# EAGLE design BRD1001-001-320 - Counting Registers (EAGLE 9.4.2)
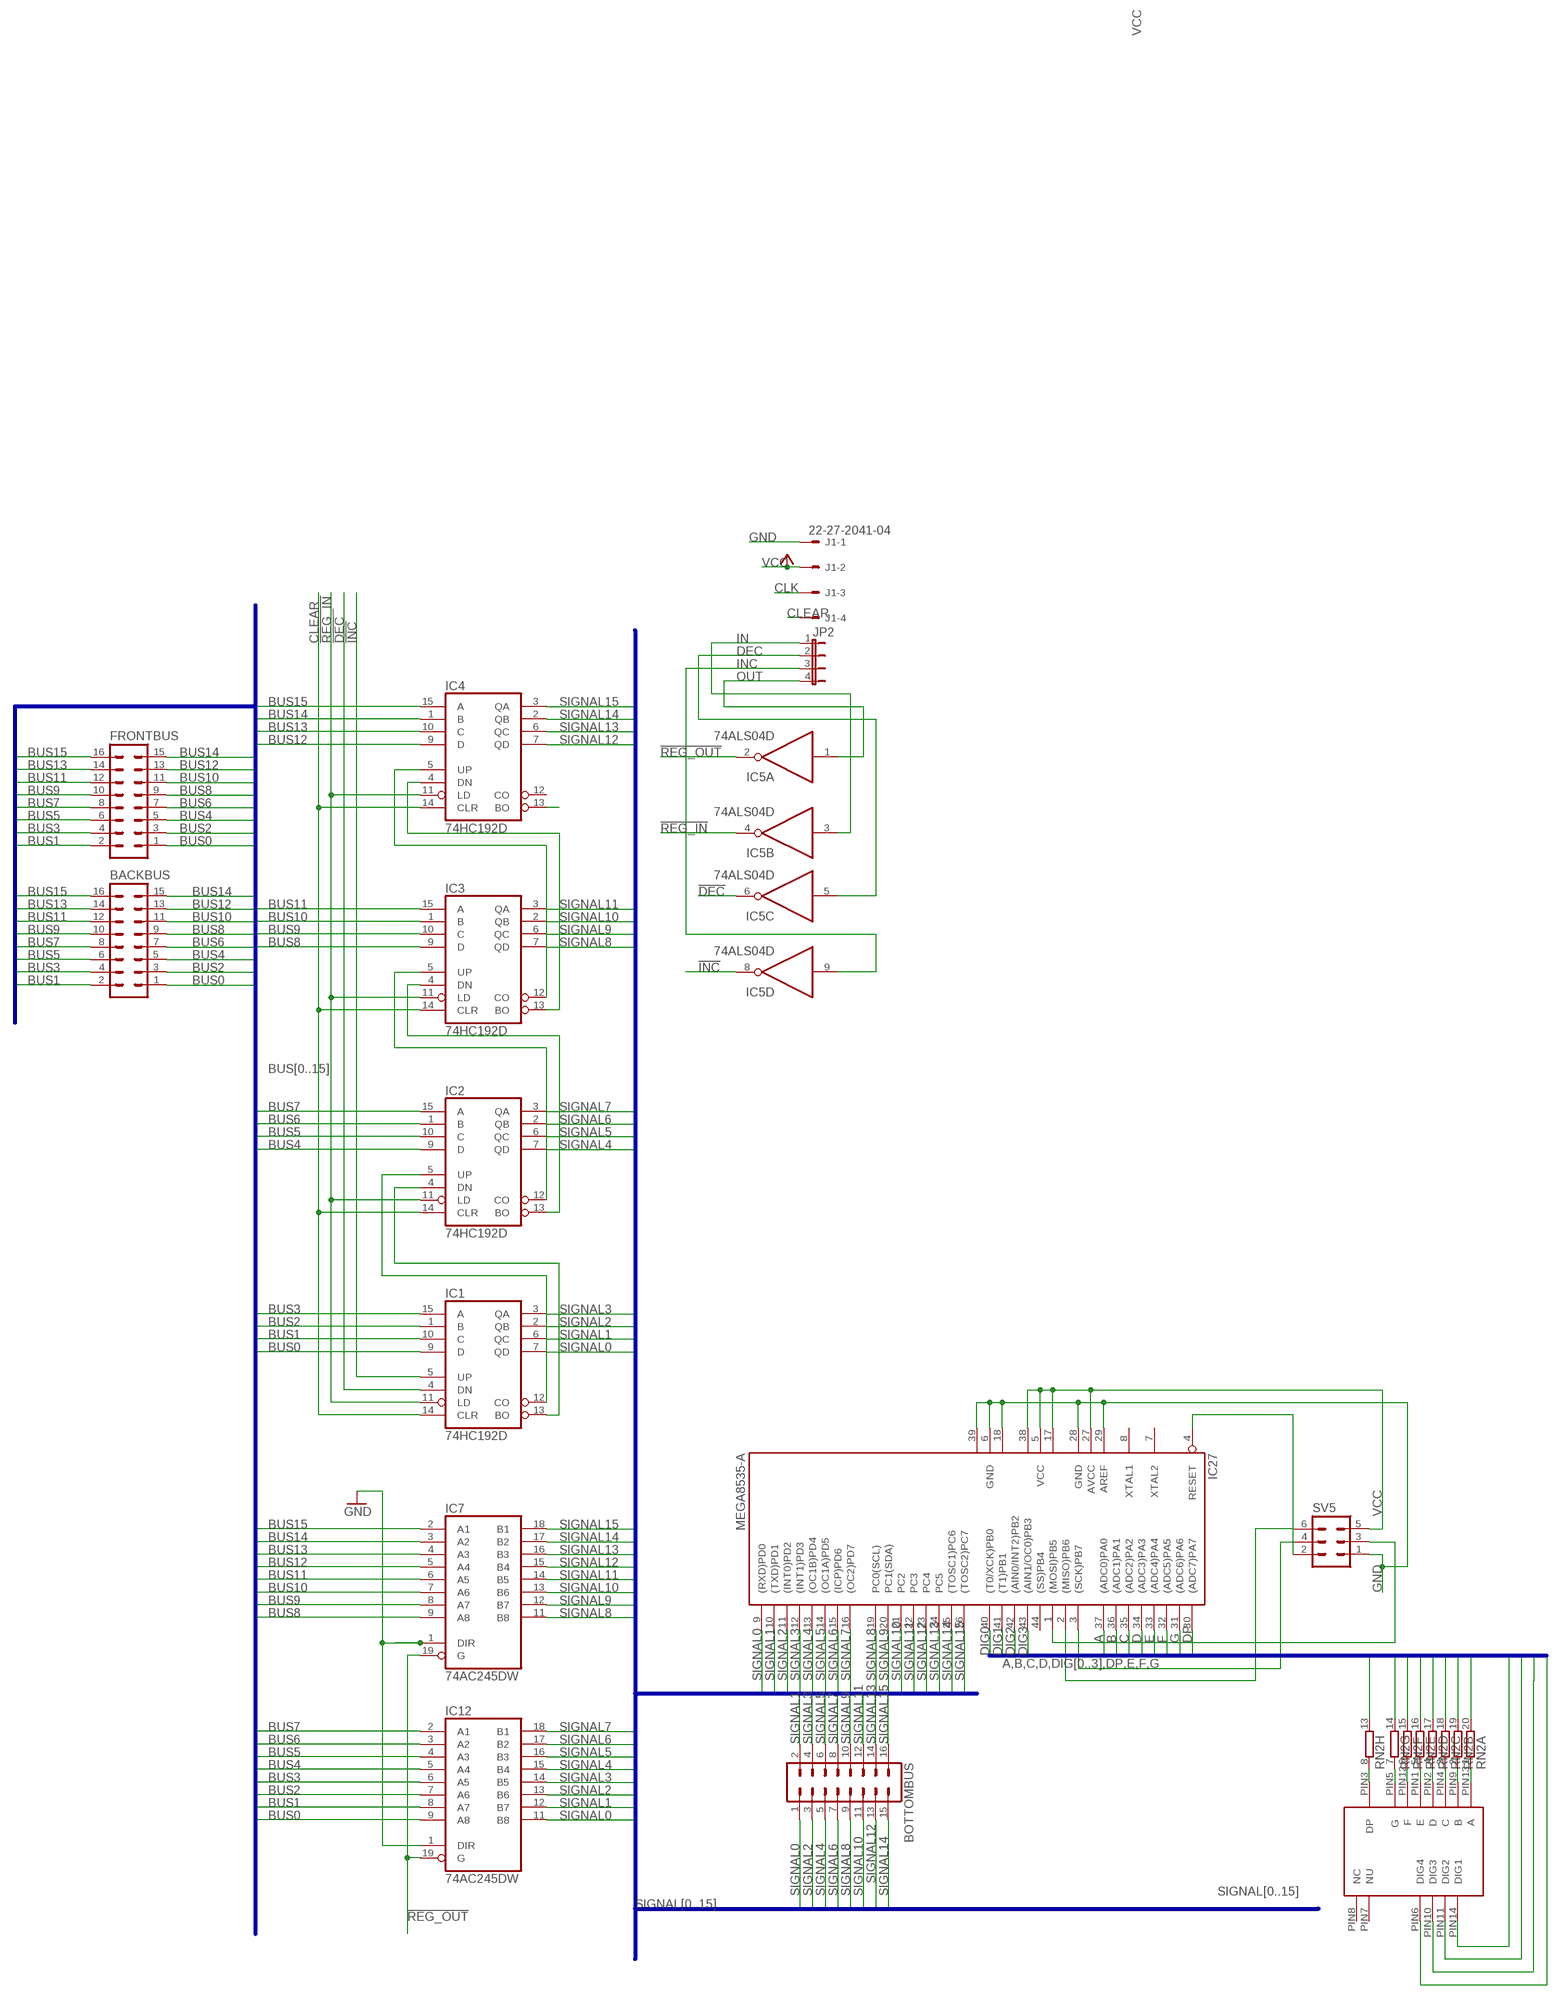
[diagram p0: schematic, sheet 1]

## Parts
BACKBUS  ML16  [ML16]
BOTTOMBUS  ML16  [ML16]
FRONTBUS  ML16  [ML16]
IC1  74HC192D  [SO16]
IC2  74HC192D  [SO16]
IC3  74HC192D  [SO16]
IC4  74HC192D  [SO16]
IC5  74ALS04D  [SO14]
IC7  74AC245DW  [SO20W]
IC12  74AC245DW  [SO20W]
IC27  MEGA8535-A  [TQFP44]
J1  22-27-2041-04  [6410-04]
JP2  JP4E  [JP4]
RN2  10R-NSOMC  [SOMC20]
SV5  ML6  [ML6]
U$1  4-DIGIT-7-SEGMENT  [4-DIGIT-7-SEGMENT]

## Nets
!DEC: IC1.4(DN) IC5.6(C:O)
!INC: IC1.5(UP) IC5.8(D:O)
!REG_IN: IC1.11(LD) IC2.11(LD) IC3.11(LD) IC4.11(LD) IC5.4(B:O)
!REG_OUT: IC5.2(A:O) IC7.19(G) IC12.19(G)
A: IC27.37((ADC0)PA0) RN2.20
B: IC27.36((ADC1)PA1) RN2.19
BUS0: BACKBUS.1 FRONTBUS.1 IC1.9(D) IC12.9(A8)
BUS1: BACKBUS.2 FRONTBUS.2 IC1.10(C) IC12.8(A7)
BUS2: BACKBUS.3 FRONTBUS.3 IC1.1(B) IC12.7(A6)
BUS3: BACKBUS.4 FRONTBUS.4 IC1.15(A) IC12.6(A5)
BUS4: BACKBUS.5 FRONTBUS.5 IC2.9(D) IC12.5(A4)
BUS5: BACKBUS.6 FRONTBUS.6 IC2.10(C) IC12.4(A3)
BUS6: BACKBUS.7 FRONTBUS.7 IC2.1(B) IC12.3(A2)
BUS7: BACKBUS.8 FRONTBUS.8 IC2.15(A) IC12.2(A1)
BUS8: BACKBUS.9 FRONTBUS.9 IC3.9(D) IC7.9(A8)
BUS9: BACKBUS.10 FRONTBUS.10 IC3.10(C) IC7.8(A7)
BUS10: BACKBUS.11 FRONTBUS.11 IC3.1(B) IC7.7(A6)
BUS11: BACKBUS.12 FRONTBUS.12 IC3.15(A) IC7.6(A5)
BUS12: BACKBUS.13 FRONTBUS.13 IC4.9(D) IC7.5(A4)
BUS13: BACKBUS.14 FRONTBUS.14 IC4.10(C) IC7.4(A3)
BUS14: BACKBUS.15 FRONTBUS.15 IC4.1(B) IC7.3(A2)
BUS15: BACKBUS.16 FRONTBUS.16 IC4.15(A) IC7.2(A1)
C: IC27.35((ADC2)PA2) RN2.18
CLEAR: IC1.14(CLR) IC2.14(CLR) IC3.14(CLR) IC4.14(CLR) J1.4
CLK: J1.3
D: IC27.34((ADC3)PA3) RN2.17
DEC: IC5.5(C:I) JP2.2
DIG0: IC27.40((T0/XCK)PB0) U$1.PIN14(DIG1)
DIG1: IC27.41((T1)PB1) U$1.PIN11(DIG2)
DIG2: IC27.42((AIN0/INT2)PB2) U$1.PIN10(DIG3)
DIG3: IC27.43((AIN1/OC0)PB3) U$1.PIN6(DIG4)
DP: IC27.30((ADC7)PA7) RN2.13
E: IC27.33((ADC4)PA4) RN2.16
F: IC27.32((ADC5)PA5) RN2.15
G: IC27.31((ADC6)PA6) RN2.14
GND: IC7.1(DIR) IC12.1(DIR) IC27.6(GND) IC27.18(GND1) IC27.28(GND) IC27.29(AREF) IC27.39(GND2) J1.1 SV5.1
IN: IC5.3(B:I) JP2.1
INC: IC5.9(D:I) JP2.3
N$1: IC4.13(BO)
N$2: IC1.12(CO) IC2.5(UP)
N$3: IC1.13(BO) IC2.4(DN)
N$4: IC2.12(CO) IC3.5(UP)
N$5: IC2.13(BO) IC3.4(DN)
N$6: IC3.12(CO) IC4.5(UP)
N$7: IC3.13(BO) IC4.4(DN)
N$18: IC27.1((MOSI)PB5) SV5.3
N$19: IC27.3((SCK)PB7) SV5.4
N$20: IC27.2((MISO)PB6) SV5.6
N$21: IC27.4(RESET) SV5.2
N$24: RN2.1 U$1.PIN13(A)
N$25: RN2.2 U$1.PIN9(B)
N$26: RN2.3 U$1.PIN4(C)
N$27: RN2.4 U$1.PIN2(D)
N$28: RN2.5 U$1.PIN1(E)
N$29: RN2.6 U$1.PIN12(F)
N$30: RN2.7 U$1.PIN5(G)
N$31: RN2.8 U$1.PIN3(DP)
OUT: IC5.1(A:I) JP2.4
SIGNAL0: BOTTOMBUS.1 IC1.7(QD) IC12.11(B8) IC27.9((RXD)PD0)
SIGNAL1: BOTTOMBUS.2 IC1.6(QC) IC12.12(B7) IC27.10((TXD)PD1)
SIGNAL2: BOTTOMBUS.3 IC1.2(QB) IC12.13(B6) IC27.11((INT0)PD2)
SIGNAL3: BOTTOMBUS.4 IC1.3(QA) IC12.14(B5) IC27.12((INT1)PD3)
SIGNAL4: BOTTOMBUS.5 IC2.7(QD) IC12.15(B4) IC27.13((OC1B)PD4)
SIGNAL5: BOTTOMBUS.6 IC2.6(QC) IC12.16(B3) IC27.14((OC1A)PD5)
SIGNAL6: BOTTOMBUS.7 IC2.2(QB) IC12.17(B2) IC27.15((ICP)PD6)
SIGNAL7: BOTTOMBUS.8 IC2.3(QA) IC12.18(B1) IC27.16((OC2)PD7)
SIGNAL8: BOTTOMBUS.9 IC3.7(QD) IC7.11(B8) IC27.19(PC0(SCL))
SIGNAL9: BOTTOMBUS.10 IC3.6(QC) IC7.12(B7) IC27.20(PC1(SDA))
SIGNAL10: BOTTOMBUS.11 IC3.2(QB) IC7.13(B6) IC27.21(PC2)
SIGNAL11: BOTTOMBUS.12 IC3.3(QA) IC7.14(B5) IC27.22(PC3)
SIGNAL12: BOTTOMBUS.13 IC4.7(QD) IC7.15(B4) IC27.23(PC4)
SIGNAL13: BOTTOMBUS.14 IC4.6(QC) IC7.16(B3) IC27.24(PC5)
SIGNAL14: BOTTOMBUS.15 IC4.2(QB) IC7.17(B2) IC27.25((TOSC1)PC6)
SIGNAL15: BOTTOMBUS.16 IC4.3(QA) IC7.18(B1) IC27.26((TOSC2)PC7)
VCC: IC27.5(VCC) IC27.17(VCC1) IC27.27(AVCC) IC27.38(VCC2) J1.2 SV5.5
Unconnected: IC4.12(CO) IC5.10(E:O) IC5.11(E:I) IC5.12(F:O) IC5.13(F:I) IC27.7(XTAL2) IC27.8(XTAL1) IC27.44((SS)PB4) RN2.9 RN2.10 RN2.11 RN2.12 U$1.PIN7(NU) U$1.PIN8(NC)

## Buses
BUS[0..15]
SIGNAL[0..15]
A,B,C,D,DIG[0..3],DP,E,F,G

## Power pins joined to a net without a drawn wire
GND: IC1.8(GND) IC2.8(GND) IC3.8(GND) IC4.8(GND) IC5.7(P:GND) IC7.10(GND) IC12.10(GND)
VCC: IC1.16(VCC) IC2.16(VCC) IC3.16(VCC) IC4.16(VCC) IC5.14(P:VCC) IC7.20(VCC) IC12.20(VCC)

## Library data of the parts
BACKBUS BOTTOMBUS FRONTBUS = con-harting-ml:ML16: HARTING; OC_FARNELL: unknown; OC_NEWARK: unknown
IC1-IC4 = 74xx-eu:74*192: Synchronous 4-bit UP/DOWN COUNTER
IC5 = 74xx-us:74*04: Hex INVERTER
IC7 IC12 = 74xx-eu:74*245: Octal BUS TRANSCEIVER, 3-state
IC27 = atmel:MEGA8535: MICROCONTROLLER 8 Kbytes FLASH 512 bytes SRAM 512 bytes EEPROM USART 8-channel 10 bit ADC Source: avr.lbr; MPN: ATMEGA8535-16AU; OC_FARNELL: 1528437; OC_NEWARK: 01M6908
J1 = con-molex:22-?-04: CONNECTOR wire to board 2.54 mm (.1 inch) pitch header; MF: MOLEX; OC_FARNELL: unknown; OC_NEWARK: unknown
JP2 = jumper:JP4E: JUMPER
RN2 = resistor-dil:10R-N: DIL RESISTOR; OC_FARNELL: unknown; OC_NEWARK: unknown
SV5 = con-harting-ml:ML6: HARTING; OC_FARNELL: unknown; OC_NEWARK: unknown
U$1 = ADAFRUIT:4-DIGIT-7-SEGMENT

## Board
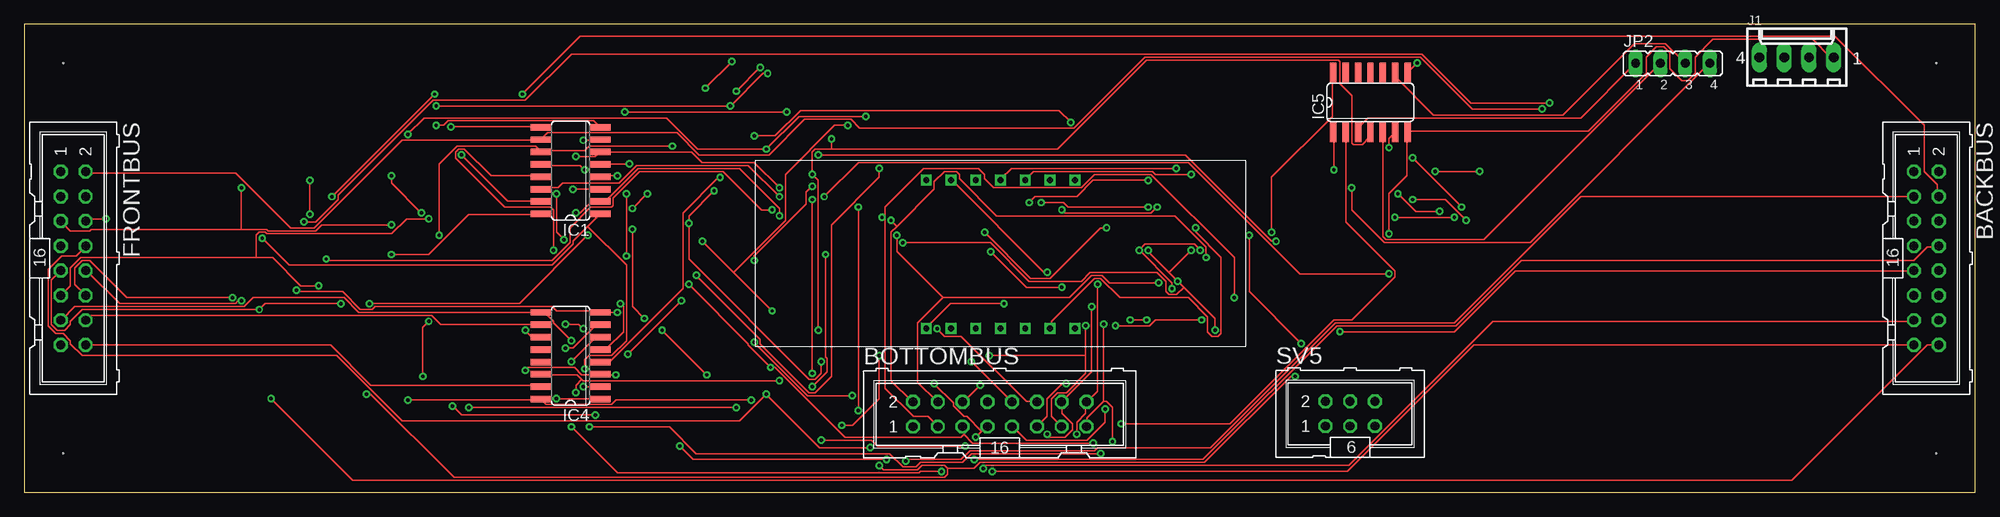
[diagram p1: board, top side]
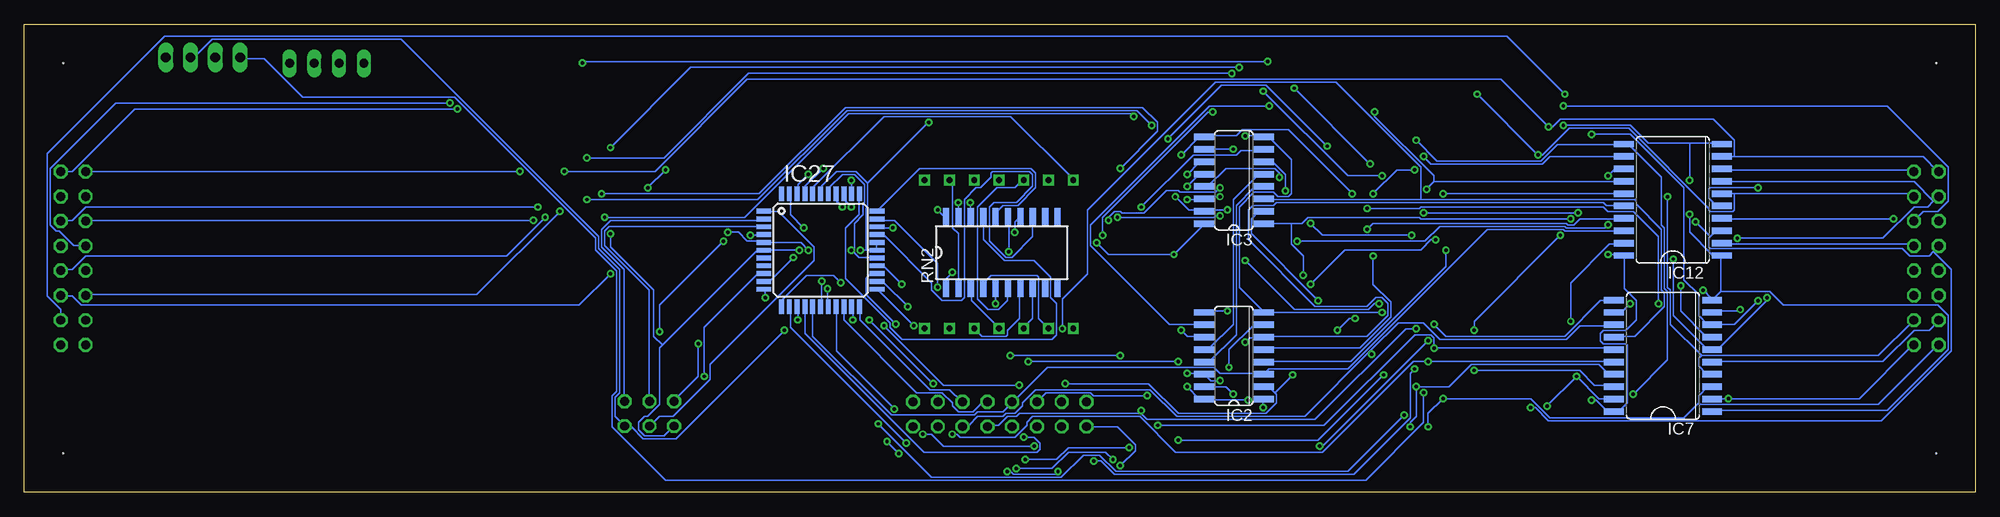
[diagram p2: board, bottom side, seen from below]

Size 200 x 48 mm. Coordinates in mm from the lower left corner, seen from the top.
Outline: 0,0 200,0 200,48 0,48 0,0
Copper layers (1*16): Top 0.035mm / dielectric 1.5mm / Bottom 0.035mm
Design rules "default": minimum track width 6mil, minimum drill 0.35mm, track to track 6mil, track to pad 6mil, pad to pad 6mil, via to via 6mil, smd to smd 6mil, copper to edge 40mil, drill to drill 6mil, minimum pad ring 10mil, minimum via ring 8mil, stop-mask expansion 4mil, vias tented up to drill 0mil, thermal gap 10mil
Holes 0.12 mm at 4,4 196,44 4,44 196,4

### Footprints (pad centres in the part's own frame; a part is rotated, then mirrored left to right if it is on the bottom)
ML16 = drill 0.914 octagon: 1 -8.89,-1.27; 2 -8.89,1.27; 3 -6.35,-1.27; 4 -6.35,1.27; 5 -3.81,-1.27; 6 -3.81,1.27; 7 -1.27,-1.27; 8 -1.27,1.27; 9 1.27,-1.27; 10 1.27,1.27; 11 3.81,-1.27; 12 3.81,1.27; 13 6.35,-1.27; 14 6.35,1.27; 15 8.89,-1.27; 16 8.89,1.27
SO16 = smd 0.66 x 2.032: 1 -4.445,-3.073; 2 -3.175,-3.073; 3 -1.905,-3.073; 4 -0.635,-3.073; 5 0.635,-3.073; 6 1.905,-3.073; 7 3.175,-3.073; 8 4.445,-3.073; 9 4.445,3.073; 10 3.175,3.073; 11 1.905,3.073; 12 0.635,3.073; 13 -0.635,3.073; 14 -1.905,3.073; 15 -3.175,3.073; 16 -4.445,3.073
SO14 = smd 0.66 x 2.032: 1 -3.81,-3.073; 2 -2.54,-3.073; 3 -1.27,-3.073; 4 0,-3.073; 5 1.27,-3.073; 6 2.54,-3.073; 7 3.81,-3.073; 8 3.81,3.073; 9 2.54,3.073; 10 1.27,3.073; 11 0,3.073; 12 -1.27,3.073; 13 -2.54,3.073; 14 -3.81,3.073
SO20W = smd 0.66 x 2.032: 1 -5.715,-5.029; 2 -4.445,-5.029; 3 -3.175,-5.029; 4 -1.905,-5.029; 5 -0.635,-5.029; 6 0.635,-5.029; 7 1.905,-5.029; 8 3.175,-5.029; 9 4.445,-5.029; 10 5.715,-5.029; 11 5.715,5.029; 12 4.445,5.029; 13 3.175,5.029; 14 1.905,5.029; 15 0.635,5.029; 16 -0.635,5.029; 17 -1.905,5.029; 18 -3.175,5.029; 19 -4.445,5.029; 20 -5.715,5.029
TQFP44 = smd 1.5 x 0.5: 1 -5.8,4; 2 -5.8,3.2; 3 -5.8,2.4; 4 -5.8,1.6; 5 -5.8,0.8; 6 -5.8,0; 7 -5.8,-0.8; 8 -5.8,-1.6; 9 -5.8,-2.4; 10 -5.8,-3.2; 11 -5.8,-4; 23 5.8,-4; 24 5.8,-3.2; 25 5.8,-2.4; 26 5.8,-1.6; 27 5.8,-0.8; 28 5.8,0; 29 5.8,0.8; 30 5.8,1.6; 31 5.8,2.4; 32 5.8,3.2; 33 5.8,4 | smd 0.5 x 1.5: 12 -4,-5.8; 13 -3.2,-5.8; 14 -2.4,-5.8; 15 -1.6,-5.8; 16 -0.8,-5.8; 17 0,-5.8; 18 0.8,-5.8; 19 1.6,-5.8; 20 2.4,-5.8; 21 3.2,-5.8; 22 4,-5.8; 34 4,5.8; 35 3.2,5.8; 36 2.4,5.8; 37 1.6,5.8; 38 0.8,5.8; 39 0,5.8; 40 -0.8,5.8; 41 -1.6,5.8; 42 -2.4,5.8; 43 -3.2,5.8; 44 -4,5.8
6410-04 = drill 1.016 long: 1 3.81,0; 2 1.27,0; 3 -1.27,0; 4 -3.81,0
JP4 = drill 0.914 long: 1 -3.81,0; 2 -1.27,0; 3 1.27,0; 4 3.81,0
SOMC20 = smd 1.91 x 0.64: 1 -3.62,5.715; 2 -3.62,4.445; 3 -3.62,3.175; 4 -3.62,1.905; 5 -3.62,0.635; 6 -3.62,-0.635; 7 -3.62,-1.905; 8 -3.62,-3.175; 9 -3.62,-4.445; 10 -3.62,-5.715; 11 3.62,-5.715; 12 3.62,-4.445; 13 3.62,-3.175; 14 3.62,-1.905; 15 3.62,-0.635; 16 3.62,0.635; 17 3.62,1.905; 18 3.62,3.175; 19 3.62,4.445; 20 3.62,5.715
ML6 = drill 0.914 octagon: 1 -2.54,-1.27; 2 -2.54,1.27; 3 0,-1.27; 4 0,1.27; 5 2.54,-1.27; 6 2.54,1.27
4-DIGIT-7-SEGMENT = drill 0.6 square: PIN1 17.48,1.88; PIN2 20.02,1.88; PIN3 22.56,1.88; PIN4 25.1,1.88; PIN5 27.64,1.88; PIN6 30.18,1.88; PIN7 32.72,1.88; PIN8 32.72,17.12; PIN9 30.18,17.12; PIN10 27.64,17.12; PIN11 25.1,17.12; PIN12 22.56,17.12; PIN13 20.02,17.12; PIN14 17.48,17.12

### Placement (x,y rotation side)
BACKBUS  195,24 270 top
BOTTOMBUS  100,8 0 top
FRONTBUS  5,24 270 top
IC1  56,33 90 top
IC2  76,14 90 bottom
IC3  76,32 90 bottom
IC4  56,14 90 top
IC5  138,40 0 top
IC7  32,14 90 bottom
IC12  31,30 90 bottom
IC27  118.38,24.83 0 bottom
J1  181.7,44.61 0 top
JP2  169,44 0 top
RN2  99.79,24.59 90 bottom
SV5  135.92,8.05 0 top
U$1  74.98,14.92 0 top

### Tracks (layer width: path | path; a pad name or v marks a point on that pad's centre or on a via)
!DEC  (via drill 0.35)
  Top 0.152: v60.81,32.46 59.13,32.46 IC1.4 | v75.44,43.59 v73,41.15 | v139.9,35.36 139.9,36.27 140.51,36.88 IC5.6
  Bottom 0.152: v60.81,32.46 64.31,32.46 v73,41.15 | v75.44,43.59 131.67,43.59 v139.9,35.36
!INC  (via drill 0.35)
  Top 0.152: v62.03,33.68 59.13,33.68 IC1.5 | v72.54,44.2 v69.8,41.45 | v142.8,44.04 141.88,43.13 IC5.8
  Bottom 0.152: v69.8,41.45 v62.03,33.68 | v72.54,44.2 142.65,44.2 v142.8,44.04
!REG_IN  (via drill 0.35)
  Top 0.152: v51.36,16.61 51.97,16 52.88,16 IC4.11 | v42.52,26.36 42.52,33.68 44.35,35.51 52.43,35.51 52.88,35.05 IC1.11 53.03,35.05 57.45,35.05 57.91,35.51 v66.45,35.51 | v81.38,16.61 81.38,32 v80.77,32.61 80.77,34.9 81.08,35.2 82.75,35.2 | 82.75,35.2 105.92,35.2 115.06,44.35 134.72,44.35 134.87,44.2 134.87,41.91 136.09,40.69 136.09,35.81 136.25,35.66 137.16,35.66 137.92,36.42 137.92,36.88 IC5.4 | 82.75,35.2 v82.75,36.27
  Bottom 0.152: v51.36,16.61 51.36,17.53 v42.52,26.36 | v81.38,16.61 80.77,16 79.1,16 IC2.11 | v80.77,32.61 79.55,33.83 79.1,33.83 IC3.11 | v66.45,35.51 72.69,41.76 77.27,41.76 v82.75,36.27
!REG_OUT  (via drill 0.35)
  Top 0.152: v40.84,11.89 40.84,16.92 v41.45,17.53 | v112.47,7.01 123.6,7.01 134.26,17.68 136.09,17.68 140.51,22.1 140.51,22.71 135.48,27.74 135.48,36.88 IC5.2 | v58.52,7.92 44.81,7.92 v43.89,8.84
  Bottom 0.152: v41.45,17.53 41.45,21.49 37.49,25.45 36.12,25.45 IC12.19 | IC7.19 37.03,9.6 38.56,9.6 v40.84,11.89 v43.89,8.84 | v112.47,7.01 106.98,1.52 93.73,1.52 91.44,3.81 89.76,3.81 88.09,2.13 64.31,2.13 v58.52,7.92
A  (via drill 0.35)
  Top 0.152: v116.13,29.26 115.52,28.65 106.68,28.65 v106.38,28.96
  Bottom 0.152: v116.13,29.26 116.74,29.87 116.74,30.48 IC27.37 | v106.38,28.96 105.61,28.19 RN2.20
B  (via drill 0.35)
  Top 0.152: v115.21,29.26 106.98,29.26 106.53,29.72 v104.24,29.72
  Bottom 0.152: v115.21,29.26 115.98,30.02 115.98,30.48 IC27.36 | v104.24,29.72 104.24,28.35 RN2.19
BUS0  (via drill 0.35)
  Top 0.152: v43.74,37.49 52.88,37.49 IC1.9 | v144.63,32.92 v149.2,32.92
  Bottom 0.152: 24.69,34.44 5.33,34.44 3.81,32.92 FRONTBUS.1 | 24.69,34.44 25.91,34.44 IC12.9 | 24.69,34.44 24.69,36.12 26.82,38.25 42.52,38.25 43.28,37.49 v43.74,37.49 48.62,42.37 125.88,42.37 135.33,32.92 v144.63,32.92 | v149.2,32.92 193.7,32.92 BACKBUS.1
BUS1  (via drill 0.35)
  Top 0.152: FRONTBUS.2 6.4,32.77 21.64,32.77 27.28,27.13 29.72,27.13 38.71,36.12 52.88,36.12 IC1.10 53.03,36.27 53.65,36.88 66.9,36.88 69.19,34.59 76.35,34.59 80.01,38.25 84.73,38.25 85.65,37.34 107.59,37.34 114.91,44.65 143.1,44.65 148.44,39.32 v155.6,39.32
  Bottom 0.152: IC12.8 25.91,33.07 6.55,33.07 6.4,32.92 FRONTBUS.2 | v155.6,39.32 188.67,39.32 195.07,32.92 196.14,32.92 BACKBUS.2
BUS2  (via drill 0.35)
  Top 0.152: 57.76,27.28 56.24,25.76 56.24,25.45 54.1,23.32 27.13,23.32 v24.38,26.06 | 57.76,27.28 58.98,28.5 IC1.1 | v90.37,3.2 90.53,3.35 96.01,3.35 96.93,4.27 109.73,4.27 110.03,4.57 121.61,4.57 134.42,17.37 146.61,17.37 159.56,30.33 193.7,30.33 BACKBUS.3 | v57.45,12.65 57.45,13.56 57.91,14.02 60.2,14.02 61.72,15.54 61.72,23.32 57.76,27.28
  Bottom 0.152: v24.38,26.06 9.45,26.06 6.25,29.26 4.88,29.26 4.27,29.87 | 4.27,29.87 3.81,30.33 FRONTBUS.3 | 4.27,29.87 6.25,31.85 25.91,31.85 IC12.7 | v90.37,3.2 89.61,3.2 88.24,1.83 63.7,1.83 57.91,7.62 57.91,12.19 v57.45,12.65
BUS3  (via drill 0.35)
  Top 0.152: v44.81,34.59 49.53,29.87 52.88,29.87 IC1.15 | v51.05,40.84 57,46.79 185.62,46.79 194.77,37.64 194.77,32.92 196.14,31.55 196.14,30.48 BACKBUS.4
  Bottom 0.152: 24.69,30.63 6.55,30.63 6.4,30.48 FRONTBUS.4 | 24.69,30.63 25.91,30.63 IC12.6 | 24.69,30.63 24.69,28.96 24.84,28.8 27.13,28.8 27.28,28.96 27.28,29.11 35.51,37.34 41.6,37.34 44.35,34.59 v44.81,34.59 v51.05,40.84
BUS4  (via drill 0.35)
  Top 0.152: v69.49,25.76 72.69,22.55 | 72.69,22.55 v76.66,18.59 | v37.64,27.43 30.48,27.43 29.87,26.82 24.99,26.82 24.84,26.98 22.25,26.98 | 22.25,26.98 6.86,26.98 6.71,26.82 4.72,26.82 3.81,27.74 FRONTBUS.5 | 22.25,26.98 v22.25,31.24 | v147.83,27.89 145.69,30.02 v142.34,30.02 | v84.43,37.64 83.06,37.64 78.03,32.61 78.03,27.89 72.69,22.55
  Bottom 0.152: v76.66,18.59 78.94,18.59 IC2.9 | v69.49,25.76 56.39,25.76 54.86,27.28 42.06,27.28 41.91,27.13 37.95,27.13 v37.64,27.43 | v22.25,31.24 27.13,31.24 27.28,31.09 27.28,30.18 26.52,29.41 26.06,29.41 IC12.5 | v147.83,27.89 193.7,27.89 BACKBUS.5 | v142.34,30.02 124.82,30.02 115.67,39.17 85.95,39.17 v84.43,37.64
BUS5  (via drill 0.35)
  Top 0.152: v42.22,39.62 v72.39,39.62 75.74,42.98 v76.2,42.98 | v8.38,28.04 6.55,28.04 6.4,27.89 FRONTBUS.6 | v142.34,34.29 v147.37,29.26
  Bottom 0.152: v72.39,39.62 78.49,39.62 90.68,27.43 90.68,25.3 82.6,17.22 79.1,17.22 IC2.10 | v42.22,39.62 8.99,39.62 2.74,33.38 2.74,29.87 3.81,28.8 5.33,28.8 6.25,27.89 FRONTBUS.6 | v8.38,28.04 25.91,28.04 IC12.4 | v147.37,29.26 193.7,29.26 195.07,27.89 196.14,27.89 BACKBUS.6 | v142.34,34.29 134.42,34.29 125.73,42.98 v76.2,42.98
BUS6  (via drill 0.35)
  Top 0.152: v45.57,8.69 v73,8.69 | v156.36,39.93 148.28,39.93 143.26,44.96 56.08,44.96 51.36,40.23 41.91,40.23 32.16,30.48 32.16,30.02 29.87,27.74 v28.65,27.74
  Bottom 0.152: 27.13,26.21 27.28,26.06 27.28,25.15 27.13,24.99 7.47,24.99 6.71,24.23 4.72,24.23 4.27,24.69 | 27.13,26.21 26.52,26.82 26.06,26.82 IC12.3 | 4.27,24.69 3.81,25.15 FRONTBUS.7 | v73,8.69 73,9.45 IC2.1 | v45.57,8.69 45.11,8.69 43.74,7.32 9.6,7.32 2.44,14.48 2.44,22.86 4.27,24.69 | v156.36,39.93 190.65,39.93 197.36,33.22 197.36,27.43 196.75,26.82 196.44,26.82 194.92,25.3 193.85,25.3 BACKBUS.7 | 27.13,26.21 v28.65,27.74
BUS7  (via drill 0.35)
  Top 0.152: FRONTBUS.8 6.25,25.15 5.33,24.23 3.81,24.23 2.44,22.86 2.44,17.07 3.2,16.31 3.96,16.31 4.72,15.54 4.72,15.24 5.94,14.02 32,14.02 38.71,7.32 73.3,7.32 v76.05,10.06 81.53,4.57 v86.72,4.57 | v97.38,3.35 120.85,3.35 134.57,17.07 146.76,17.07 153.47,23.77 193.7,23.77 195.07,25.15 196.14,25.15 BACKBUS.8
  Bottom 0.152: v76.05,10.06 76.81,10.82 78.94,10.82 IC2.15 | IC12.2 25.91,25.45 6.55,25.45 6.4,25.3 FRONTBUS.8 | v97.38,3.35 94.18,3.35 92.96,4.57 v86.72,4.57
BUS8  (via drill 0.35)
  Top 0.152: FRONTBUS.9 3.66,22.71 2.74,21.79 2.74,17.22 3.35,16.61 4.12,16.61 4.72,17.22 4.72,17.53 5.94,18.75 v24.08,18.75 24.69,19.36 v32.46,19.36 | v62.33,29.11 v63.86,30.63 | v134.87,16.46 146.61,16.46 152.86,22.71 193.7,22.71 BACKBUS.9 | v128.32,25.76 127.86,25.76 119.02,34.59 v81.38,34.59
  Bottom 0.152: v24.08,18.75 24.23,18.59 26.82,18.59 IC7.9 | v63.86,30.63 70.41,37.19 75.13,37.19 75.74,36.58 78.94,36.58 IC3.9 79.1,36.42 79.55,36.42 v81.38,34.59 | v62.33,29.11 57,29.11 56.84,29.26 38.1,29.26 37.64,28.8 35.05,28.8 32.46,26.21 v32.46,19.36 | v134.87,16.46 134.87,19.2 v128.32,25.76
BUS9  (via drill 0.35)
  Top 0.152: v22.25,19.66 21.95,19.66 21.64,19.36 9.75,19.36 6.4,22.71 FRONTBUS.10 | v39.32,36.73 41,38.41 65.84,38.41 69.04,35.2 v76.05,35.2 79.4,38.56 v86.26,38.56 | v140.51,28.19 v146.61,28.19
  Bottom 0.152: v22.25,19.66 24.69,17.22 26.82,17.22 IC7.8 26.98,17.22 27.43,17.22 28.35,18.14 28.35,20.27 29.87,21.79 29.87,31.24 35.36,36.73 v39.32,36.73 | v76.05,35.2 78.94,35.2 IC3.10 | v146.61,28.19 150.57,24.23 193.7,24.23 195.07,22.86 196.14,22.86 BACKBUS.10 | v140.51,28.19 126.19,28.19 115.52,38.86 86.56,38.86 v86.26,38.56
BUS10  (via drill 0.35)
  Top 0.152: v30.18,21.18 28.35,21.18 25.45,24.08 23.77,24.08 | 23.77,24.08 5.79,24.08 4.72,23.01 4.72,21.18 3.81,20.27 FRONTBUS.11 | v41.45,28.04 39.17,28.04 37.64,26.52 24.84,26.52 24.69,26.67 24.08,26.67 23.77,26.36 23.77,24.08 | v145.09,28.8 142.65,28.8 v140.82,30.63 | v87.63,33.22 87.63,32.31 82.75,27.43 82.75,11.89 81.08,10.21 80.47,10.21 75.44,15.24 75.44,15.7 v68.89,22.25
  Bottom 0.152: v30.18,21.18 30.18,18.59 27.58,16 26.98,16 IC7.7 | 70.1,27.58 69.04,27.58 68.43,28.19 57,28.19 56.84,28.04 v41.45,28.04 | 70.1,27.58 72.85,27.58 IC3.1 | v145.09,28.8 153.62,20.27 193.7,20.27 BACKBUS.11 | v140.82,30.63 124.66,30.63 115.82,39.47 85.34,39.47 83.82,37.95 83.82,37.03 v87.63,33.22 | v68.89,22.25 68.89,24.23 70.1,25.45 70.1,27.58
BUS11  (via drill 0.35)
  Top 0.152: v21.34,19.96 10.52,19.96 6.71,23.77 5.94,23.77 5.18,23.01 5.18,21.34 6.25,20.27 FRONTBUS.12 | v76.66,28.96 75.59,28.96 71.63,32.92 63.09,32.92 60.35,30.18 60.35,29.41 60.2,29.26 58.06,29.26 55.93,27.13 55.93,25.6 54.1,23.77 31.09,23.77 v30.94,23.93 | v139.9,22.4 130.76,22.4 119.33,33.83 85.5,33.83 v81.99,30.33
  Bottom 0.152: v21.34,19.96 21.34,19.66 26.21,14.78 26.82,14.78 IC7.6 26.98,14.78 27.58,14.78 30.94,18.14 v30.94,23.93 | v76.66,28.96 78.94,28.96 IC3.15 79.1,28.96 80.62,28.96 v81.99,30.33 | v139.9,22.4 143.1,19.2 194.16,19.2 195.07,20.12 196.14,20.12 BACKBUS.12
BUS12  (via drill 0.35)
  Top 0.152: FRONTBUS.13 3.81,17.68 5.18,19.05 22.55,19.05 23.47,19.96 32.77,19.96 34.29,18.44 52.88,18.44 IC4.9 53.03,18.44 53.34,18.44 54.25,17.53 54.25,17.37 v56.08,15.54 | v98.3,2.44 98.6,2.74 135.79,2.74 150.57,17.53 193.7,17.53 BACKBUS.13 | v88.39,3.35 68.58,3.35 v67.21,4.72
  Bottom 0.152: IC7.5 26.82,13.41 9.45,13.41 6.25,16.61 4.72,16.61 3.81,17.53 FRONTBUS.13 | v98.3,2.44 94.64,2.44 92.96,4.12 89.15,4.12 v88.39,3.35 | v67.21,4.72 66.9,4.72 v56.08,15.54
BUS13  (via drill 0.35)
  Top 0.152: IC4.10 52.88,17.22 42.67,17.22 41.76,18.14 6.86,18.14 6.4,17.68 FRONTBUS.14 | v31.55,30.33 v42.06,40.84
  Bottom 0.152: 28.04,14.02 28.35,13.72 28.35,12.95 27.58,12.19 26.98,12.19 IC7.4 | 28.04,14.02 9.91,14.02 6.4,17.53 FRONTBUS.14 | v42.06,40.84 48.01,46.79 185.62,46.79 197.66,34.75 197.66,20.12 196.29,18.75 196.29,17.68 BACKBUS.14 | v31.55,30.33 31.55,21.03 31.24,20.73 31.24,17.22 28.04,14.02
BUS14  (via drill 0.35)
  Top 0.152: v54.56,9.6 58.98,9.6 IC4.1 | v99.21,2.13 135.64,2.13 148.59,15.09 193.7,15.09 BACKBUS.15 | v94.03,2.13 91.9,2.13 91.75,1.98 60.81,1.98 v56.08,6.71
  Bottom 0.152: 28.35,9.14 28.35,9.91 27.43,10.82 IC7.3 | 28.35,9.14 28.19,8.99 9.91,8.99 3.81,15.09 FRONTBUS.15 | 28.35,9.14 29.87,7.62 43.59,7.62 45.57,9.6 v54.56,9.6 56.08,8.08 v56.08,6.71 | v99.21,2.13 98.91,2.13 98.6,1.83 94.34,1.83 v94.03,2.13
BUS15  (via drill 0.35)
  Top 0.152: IC4.15 52.88,10.97 35.51,10.97 31.39,15.09 6.4,15.09 FRONTBUS.16 | v25.3,9.6 33.68,1.22 181.2,1.22 195.07,15.09 196.14,15.09 BACKBUS.16
  Bottom 0.152: IC7.2 26.82,9.6 v25.3,9.6 11.89,9.6 6.4,15.09 FRONTBUS.16
C  (via drill 0.35)
  Top 0.152: v115.21,32 109.58,32 107.9,30.33 103.63,30.33 v103.02,29.72
  Bottom 0.152: v115.21,32 115.21,30.63 IC27.35 | v103.02,29.72 103.02,28.35 RN2.18
CLEAR  (via drill 0.35)
  Top 0.152: v77.42,30.33 74.22,33.53 62.79,33.53 60.96,31.7 55.17,31.7 54.71,31.24 53.03,31.24 IC1.14 | 57.15,11.58 57.3,11.43 v77.42,11.43 | 57.15,11.58 56.69,12.04 53.03,12.04 IC4.14 | v56.54,10.21 56.54,10.97 57.15,11.58 | v80.77,12.19 v80.77,30.02
  Bottom 0.152: v77.42,30.33 78.79,30.33 78.94,30.18 IC3.14 79.1,30.02 v80.77,30.02 | v77.42,11.43 78.33,11.43 78.94,12.04 IC2.14 79.1,12.19 v80.77,12.19 | v56.54,10.21 56.54,7.16 62.48,1.22 134.26,1.22 139.75,6.71 139.75,9.91 139.29,10.36 139.29,22.71 141.43,24.84 141.43,26.06 155.91,40.54 171.45,40.54 175.41,44.5 177.85,44.5 J1.4
D
  Bottom 0.152: IC27.34 114.45,30.48 114.45,28.5 115.82,27.13 115.82,21.95 111.25,17.37 111.25,16.92 110.03,15.7 94.64,15.7 94.18,16.15 94.18,19.36 94.79,19.96 94.79,22.1 96.47,23.77 99.52,23.77 101.65,25.91 101.65,28.19 RN2.17
DEC
  Top 0.152: IC5.5 139.29,36.88 139.29,26.21 139.6,25.91 149.66,25.91 167.64,43.89 JP2.2
DIG0
  Bottom 0.152: IC27.40 119.18,31.24 111.86,38.56 98.91,38.56 92.51,32.16 U$1.PIN14
DIG1  (via drill 0.35)
  Top 0.152: v118.11,33.22 101.19,33.22 100.13,32.16 U$1.PIN11
  Bottom 0.152: v118.11,33.22 119.94,31.39 119.94,30.63 IC27.41
DIG2  (via drill 0.35)
  Top 0.152: v119.63,32.61 115.98,32.61 115.67,32.92 103.48,32.92 102.72,32.16 U$1.PIN10
  Bottom 0.152: v119.63,32.61 120.7,31.55 120.7,30.63 IC27.42
DIG3  (via drill 0.35)
  Top 0.152: v120.09,27.13 120.09,26.67 122.68,24.08 122.68,16.31 122.38,16 121.77,16 121.31,16.46 121.31,17.98 119.33,19.96 112.32,19.96 110.34,21.95 109.73,21.95 105.31,17.53 105.31,16.92 U$1.PIN6
  Bottom 0.152: v120.09,27.13 121.46,28.5 121.46,30.48 IC27.43
DP
  Bottom 0.152: IC27.30 112.47,26.36 111.86,26.36 106.98,21.49 106.98,20.73 105.92,19.66 103.94,19.66 103.63,19.96 103.63,30.02 102.41,31.24 101.96,31.24 100.89,32.31 100.89,32.77 100.74,32.92 96.93,32.92 96.62,32.61 96.62,31.39 98.3,29.72 100.58,29.72 101.04,29.26 101.04,25.76 99.36,24.08 98.75,24.08 96.62,26.21 96.62,28.19 RN2.13
E
  Bottom 0.152: IC27.33 112.47,28.96 108.2,33.22 96.77,33.22 96.32,32.77 96.32,31.24 98.15,29.41 99.67,29.41 100.28,28.8 100.28,28.35 RN2.16
F  (via drill 0.35)
  Top 0.152: v106.38,21.03 102.72,21.03 v99.06,24.69
  Bottom 0.152: v106.38,21.03 106.38,23.47 110.8,27.89 112.47,27.89 IC27.32 | v99.06,24.69 99.06,28.19 RN2.15
G  (via drill 0.35)
  Top 0.152: v110.95,27.13 110.34,27.13 105.16,21.95 103.17,21.95 v98.45,26.67
  Bottom 0.152: v110.95,27.13 112.47,27.13 IC27.31 | v98.45,26.67 98.45,27.74 97.99,28.19 RN2.14
GND  (via drill 0.35)
  Top 0.152: v42.22,37.64 42.98,37.64 43.43,38.1 58.37,38.1 58.98,37.49 IC1.8 | v60.81,18.44 59.13,18.44 IC4.8 58.98,18.59 54.56,18.59 54.1,19.05 35.97,19.05 35.66,18.75 34.44,18.75 32.61,20.57 28.04,20.57 v27.89,20.73 | v29.26,28.5 v29.26,32 | v117.65,20.88 117.65,21.49 v114.3,24.84 114.91,25.45 119.94,25.45 v120.55,24.84 | v139.9,26.52 139.9,30.63 141.73,32.46 141.73,36.88 IC5.7 141.88,37.03 160.32,37.03 166.27,42.98 166.27,44.65 167.34,45.72 168.1,45.72 168.71,45.11 168.71,43.43 169.93,42.22 170.54,42.22 171.3,42.98 171.3,44.65 173.13,46.48 183.34,46.48 185.17,44.65 185.47,44.65 J1.1 | v74.83,36.58 76.96,36.58 79.55,39.17 106.07,39.17 v107.29,37.95
  Bottom 0.152: 29.26,35.81 33.53,35.81 35.36,37.64 v42.22,37.64 | 29.26,35.81 26.06,35.81 IC12.10 | v60.81,18.44 72.85,18.44 IC2.8 73,18.59 75.44,21.03 75.44,29.26 73.91,30.79 71.93,30.79 71.48,30.33 70.41,30.33 70.1,30.63 70.1,34.14 72.39,36.42 72.85,36.42 IC3.8 73,36.58 v74.83,36.58 | 26.06,20.57 21.03,20.57 19.66,19.2 3.81,19.2 2.74,18.14 2.74,14.63 8.99,8.38 26.82,8.38 IC7.1 | 26.06,20.57 26.82,19.81 IC7.10 26.98,19.81 v27.89,20.73 | 26.06,20.57 26.06,24.23 IC12.1 26.06,24.38 26.98,24.38 29.26,26.67 v29.26,28.5 | v29.26,32 29.26,35.81 | 112.62,24.84 112.62,25.6 IC27.29 | v117.65,20.88 117.65,19.05 IC27.18 | 112.62,24.84 113.69,24.84 | 113.69,24.84 v114.3,24.84 | 112.62,24.84 IC27.28 | 113.54,31.7 114.76,32.92 116.74,32.92 118.26,31.39 118.26,30.63 IC27.39 | 113.54,31.7 113.54,29.26 113.69,29.11 113.69,24.84 | 134.57,15.09 134.87,14.78 134.87,8.99 136.09,7.77 136.4,7.77 137.01,7.16 137.01,6.4 136.4,5.79 134.42,5.79 133.5,6.71 SV5.1 | 134.57,15.09 124.97,24.69 124.21,24.69 IC27.6 124.05,24.84 v120.55,24.84 | v139.9,26.52 139.9,25.15 135.48,20.73 135.48,16 134.57,15.09 | 113.54,31.7 v107.29,37.95
IN
  Top 0.152: IC5.3 136.85,37.03 136.85,37.49 137.77,38.41 159.56,38.41 165.05,43.89 JP2.1
INC
  Top 0.152: IC5.9 140.66,42.98 140.66,42.52 144.47,38.71 157.73,38.71 165.05,46.02 168.25,46.02 170.23,44.04 JP2.3
N$2  (via drill 0.35)
  Top 0.152: v57.45,33.07 57,33.53 53.03,33.53 IC1.12 | v61.72,24.23 v61.72,30.63
  Bottom 0.152: v57.45,33.07 59.28,33.07 v61.72,30.63 | v61.72,24.23 61.72,21.34 59.89,19.51 59.89,17.98 63.09,14.78 72.85,14.78 IC2.5
N$3  (via drill 0.35)
  Top 0.152: v54.25,24.84 54.25,28.96 53.95,29.26 49.23,29.26 44.2,34.29 44.2,34.9 44.5,35.2 45.11,35.2 47.85,32.46 52.88,32.46 IC1.13
  Bottom 0.152: v54.25,24.84 54.25,23.16 64.01,13.41 72.85,13.41 IC2.4
N$4
  Bottom 0.152: IC3.5 73,32.61 73.46,32.61 76.05,30.02 76.05,17.22 78.49,14.78 78.94,14.78 IC2.12
N$5
  Bottom 0.152: IC3.4 73,31.24 73.91,31.24 75.74,29.41 75.74,16.15 78.49,13.41 78.94,13.41 IC2.13
N$6  (via drill 0.35)
  Top 0.152: v61.11,19.36 61.42,19.05 61.42,16.46 59.74,14.78 59.13,14.78 IC4.5 | v74.83,23.77 74.83,24.23 80.16,29.57 80.16,30.79 v80.77,31.39
  Bottom 0.152: v61.11,19.36 61.57,19.36 62.18,18.75 69.8,18.75 v74.83,23.77 | v80.77,31.39 79.55,32.61 79.1,32.61 IC3.12
N$7  (via drill 0.35)
  Top 0.152: v71.32,32.31 71.17,32.31 67.51,28.65 67.51,20.88 60.05,13.41 59.13,13.41 IC4.4
  Bottom 0.152: v71.32,32.31 71.32,32.77 71.78,33.22 76.81,33.22 78.64,31.39 78.94,31.39 IC3.13
N$18
  Bottom 0.152: IC27.1 124.05,28.8 122.68,28.8 119.02,25.15 119.02,23.77 129.69,13.11 129.69,11.58 133.5,7.77 134.87,7.77 135.79,6.86 SV5.3
N$19
  Bottom 0.152: IC27.3 124.21,27.28 140.06,27.28 140.51,26.82 140.51,25.3 135.94,20.73 135.94,9.45 SV5.4
N$20
  Bottom 0.152: IC27.2 124.21,27.89 139.9,27.89 140.82,26.98 140.82,25.15 138.53,22.86 138.53,9.45 SV5.6
N$21  (via drill 0.35)
  Top 0.152: v125.58,26.36 125.58,20.57 v130.91,15.24
  Bottom 0.152: v125.58,26.36 124.21,26.36 IC27.4 | v130.91,15.24 130.91,11.89 133.35,9.45 SV5.2
N$24  (via drill 0.35)
  Top 0.152: v104.85,22.55 104.55,22.55 95.1,32 U$1.PIN13
  Bottom 0.152: v104.85,22.55 105.46,21.95 105.46,21.03 RN2.1
N$25
  Bottom 0.152: RN2.2 104.24,21.03 104.24,26.52 104.85,27.13 104.85,31.7 105.16,32 U$1.PIN9
N$26
  Bottom 0.152: RN2.3 102.87,20.88 102.87,19.66 100.13,16.92 U$1.PIN4
N$27
  Bottom 0.152: RN2.4 101.65,21.03 101.65,21.49 100.89,22.25 96.16,22.25 96.01,22.1 96.01,17.83 95.1,16.92 U$1.PIN2
N$28  (via drill 0.35)
  Top 0.152: v100.43,19.36 94.94,19.36 92.51,16.92 U$1.PIN1
  Bottom 0.152: v100.43,19.36 100.43,20.88 RN2.5
N$29
  Bottom 0.152: RN2.6 99.21,20.88 99.21,19.66 100.13,18.75 101.19,18.75 102.26,19.81 102.26,29.26 100.28,31.24 98.45,31.24 97.69,32 U$1.PIN12
N$30
  Bottom 0.152: RN2.7 97.99,20.88 97.99,17.83 99.21,16.61 99.21,16.15 99.36,16 101.8,16 102.56,16.76 U$1.PIN5
N$31
  Bottom 0.152: RN2.8 96.62,20.88 96.62,17.83 97.54,16.92 U$1.PIN3
OUT  (via drill 0.35)
  Top 0.152: v134.26,33.07 134.26,36.88 IC5.1 | v136.09,31.24 136.09,28.96 139.45,25.6 154.38,25.6 172.67,43.89 JP2.4
  Bottom 0.152: v136.09,31.24 v134.26,33.07
SIGNAL0  (via drill 0.35)
  Top 0.152: v57.3,36.12 58.98,36.12 IC1.7 | v130.3,11.89 129.84,11.89 121.01,3.05 97.99,3.05 97.38,2.44 94.64,2.44 | 94.64,2.44 94.34,2.74 92.05,2.74 91.59,2.29 88.09,2.29 v87.63,2.74 | v35.05,10.06 35.51,10.06 44.04,1.52 94.34,1.52 94.64,1.83 94.64,2.44
  Bottom 0.152: v57.3,36.12 55.17,33.98 44.5,33.98 42.82,35.66 36.12,35.66 IC12.11 35.97,35.66 35.51,35.66 32.16,32.31 32.16,27.43 31.85,27.13 31.85,20.88 31.55,20.57 31.55,13.56 v35.05,10.06 | v130.3,11.89 130.3,16.92 124.82,22.4 124.21,22.4 IC27.9 | v87.63,2.74 86.11,4.27 86.11,4.88 87.94,6.71 90.98,6.71 BOTTOMBUS.1
SIGNAL1  (via drill 0.35)
  Top 0.152: v56.54,34.44 58.52,34.44 58.98,34.9 IC1.6 59.13,34.9 68.43,34.9 69.49,33.83 74.83,33.83 v77.42,31.24 | v121.16,24.08 121.16,25.15 117.96,28.35 99.67,28.35 95.86,32.16 95.86,32.61 95.56,32.92 94.34,32.92 93.27,31.85 93.27,31.09 89.46,27.28 | 89.46,27.28 88.85,26.67 88.85,11.43 90.98,9.3 BOTTOMBUS.2 | 89.46,27.28 v88.85,27.89
  Bottom 0.152: v56.54,34.44 55.78,33.68 44.35,33.68 43.59,34.44 36.12,34.44 IC12.12 | v121.16,24.08 123.6,21.64 124.05,21.64 IC27.10 | v77.42,31.24 77.88,30.79 81.53,30.79 81.69,30.94 82.91,30.94 85.19,28.65 87.48,28.65 87.63,28.8 88.24,28.8 88.85,28.19 v88.85,27.89
SIGNAL2  (via drill 0.35)
  Top 0.152: v124.05,19.96 124.05,24.08 115.52,32.61 109.73,32.61 108.36,31.24 99.36,31.24 98.45,32.16 98.45,32.61 97.84,33.22 92.2,33.22 88.24,29.26 88.24,28.19 | 88.24,28.19 88.24,10.67 91.14,7.77 92.66,7.77 93.57,6.86 BOTTOMBUS.3 | v77.42,28.35 77.42,29.11 73.3,33.22 62.94,33.22 59.59,29.87 59.13,29.87 IC1.2 58.98,29.72 58.06,29.72 57,28.65 v56.54,28.65 | 88.24,28.19 v87.94,28.19 | v37.64,32.46 37.64,31.7 v40.69,28.65
  Bottom 0.152: v124.05,19.96 124.05,20.73 IC27.11 | v77.42,28.35 77.88,28.35 78.03,28.19 v87.94,28.19 | v37.64,32.46 37.03,33.07 36.12,33.07 IC12.13 | v56.54,28.65 v40.69,28.65
SIGNAL3  (via drill 0.35)
  Top 0.152: v56.24,31.09 58.98,31.09 IC1.3 | v116.28,21.49 111.25,21.49 110.49,22.25 109.42,22.25 107.14,19.96 94.18,19.96 | 94.18,19.96 91.59,17.37 91.59,11.28 93.57,9.3 BOTTOMBUS.4 | v78.18,39.01 v61.57,39.01 | v89.46,26.36 89.46,24.69 94.18,19.96
  Bottom 0.152: 55.47,31.85 36.12,31.85 IC12.14 | v56.24,31.09 55.47,31.85 | v116.28,21.49 117.04,22.25 119.79,22.25 122.38,19.66 122.38,19.05 IC27.12 | 55.47,31.85 55.47,32.46 61.57,38.56 v61.57,39.01 | v78.18,39.01 78.64,39.01 89.46,28.19 v89.46,26.36
SIGNAL4  (via drill 0.35)
  Top 0.152: v109.58,5.03 97.23,5.03 96.32,5.94 | 96.32,5.94 96.32,6.71 BOTTOMBUS.5 | 96.32,5.94 96.01,5.64 84.12,5.64 76.96,12.8 v76.5,12.8 74.22,15.09 74.22,15.24 v68.12,21.34 | v54.56,30.63 54.56,26.67 v55.32,25.91
  Bottom 0.152: v109.58,5.03 121.46,16.92 121.46,18.9 IC27.13 | v76.5,12.8 76.5,14.63 74.07,17.07 73,17.07 IC2.7 | v54.56,30.63 36.12,30.63 IC12.15 | v55.32,25.91 55.78,25.91 56.84,24.84 64.62,24.84 v68.12,21.34
SIGNAL5  (via drill 0.35)
  Top 0.152: v120.7,17.68 115.98,17.68 115.37,17.07 v111.86,17.07 | v97.99,10.97 96.32,9.3 BOTTOMBUS.6 | v74.83,15.39 80.31,9.91 v84.89,9.91
  Bottom 0.152: v120.7,17.68 120.7,18.9 IC27.14 | v111.86,17.07 105.77,10.97 v97.99,10.97 | v74.83,15.39 74.37,15.85 73,15.85 IC2.6 72.85,16 62.33,16 60.2,18.14 60.2,19.36 60.81,19.96 61.42,19.96 62.33,19.05 67.67,19.05 74.52,25.91 74.52,28.96 74.07,29.41 71.93,29.41 71.63,29.72 38.1,29.72 37.8,29.41 36.12,29.41 IC12.16 | v84.89,9.91 90.37,9.91 90.68,10.21 95.25,10.21 96.16,9.3 BOTTOMBUS.6
SIGNAL6  (via drill 0.35)
  Top 0.152: 98.15,6.25 98.6,6.71 BOTTOMBUS.7 | 98.15,6.25 v97.54,5.64 | v93.27,11.12 95.25,9.14 95.25,8.84 96.32,7.77 96.62,7.77 98.15,6.25 | v62.33,26.98 62.33,19.05 v63.55,17.83 | v69.95,12.04 v65.38,16.61
  Bottom 0.152: v97.54,5.64 96.47,5.64 95.86,5.03 95.86,4.42 96.16,4.12 107.75,4.12 119.94,16.31 119.94,18.9 IC27.15 | 71.78,10.21 71.63,10.06 71.63,9.14 72.69,8.08 81.69,8.08 84.73,11.12 v93.27,11.12 | 71.78,10.21 72.39,10.82 72.85,10.82 IC2.2 | v62.33,26.98 61.72,27.58 41.91,27.58 41.76,27.43 41.15,27.43 40.54,28.04 36.12,28.04 IC12.17 | v63.55,17.83 64.16,17.83 v65.38,16.61 | 71.78,10.21 v69.95,12.04
SIGNAL7
  Bottom 0.152: IC27.16 119.18,18.9 119.18,16 111.1,7.92 102.56,7.92 102.26,8.23 99.67,8.23 98.75,9.14 BOTTOMBUS.8 98.6,9.3 95.1,12.8 78.03,12.8 77.42,12.19 73,12.19 IC2.3 72.85,12.19 72.39,12.65 64.31,12.65 49.99,26.98 42.22,26.98 42.06,26.82 36.12,26.82 IC12.18
SIGNAL8  (via drill 0.35)
  Top 0.152: v110.8,8.53 110.8,7.16 108.97,5.33 102.72,5.33 101.35,6.71 BOTTOMBUS.9 | v55.47,17.22 56.84,17.22 v57.3,16.76 | v85.5,8.38 v85.5,29.26
  Bottom 0.152: v110.8,8.53 116.74,14.48 116.74,18.9 IC27.19 | v55.47,17.22 54.25,16 42.06,16 38.41,19.66 37.03,19.66 IC7.11 | v57.3,16.76 58.37,16.76 67.67,7.47 84.89,7.47 85.5,8.08 | 85.5,8.08 97.99,8.08 98.3,7.77 99.21,7.77 100.13,6.86 101.19,6.86 BOTTOMBUS.9 | v85.5,29.26 80.16,34.59 75.74,34.59 75.29,35.05 73,35.05 IC3.7 | 85.5,8.08 v85.5,8.38
SIGNAL9  (via drill 0.35)
  Top 0.152: v35.36,19.36 50.75,19.36 v57.76,26.36 | v70.71,30.94 68.12,28.35 v68.12,27.58 68.12,23.93 80.47,11.58 81.08,11.58 81.69,12.19 v81.69,13.41 | v97.08,13.41 101.19,9.3 BOTTOMBUS.10
  Bottom 0.152: IC27.20 115.98,18.9 115.98,17.68 108.51,10.21 105.92,10.21 104.85,9.14 104.85,8.84 104.24,8.23 102.72,8.23 101.8,9.14 101.35,9.14 BOTTOMBUS.10 | v35.36,19.36 36.12,18.59 36.88,18.59 IC7.12 | v57.76,26.36 66.9,26.36 v68.12,27.58 | v70.71,30.94 70.71,32.61 71.93,33.83 72.85,33.83 IC3.6 | v81.69,13.41 v97.08,13.41
SIGNAL10  (via drill 0.35)
  Top 0.152: v113.39,17.68 v115.06,17.68 | v106.83,11.12 106.38,11.12 104.85,9.6 104.85,7.77 103.94,6.86 BOTTOMBUS.11 | v61.87,14.17 v67.36,19.66
  Bottom 0.152: v115.06,17.68 115.06,18.9 IC27.21 | v106.83,11.12 v113.39,17.68 | 61.87,14.63 68.73,7.77 81.84,7.77 84.58,10.52 96.32,10.52 97.69,9.14 97.69,8.84 98.45,8.08 99.36,8.08 99.67,7.77 102.26,7.77 103.17,6.86 103.78,6.86 BOTTOMBUS.11 | 61.87,14.63 59.13,17.37 56.54,17.37 54.86,15.7 41.91,15.7 40.54,17.07 37.03,17.07 IC7.13 | v67.36,19.66 74.22,26.52 74.22,28.04 73.46,28.8 73,28.8 IC3.2 | 61.87,14.63 v61.87,14.17
SIGNAL11  (via drill 0.35)
  Top 0.152: v93.57,16.76 94.34,16 96.01,16 102.72,9.3 103.78,9.3 BOTTOMBUS.12
  Bottom 0.152: IC27.22 114.3,18.9 114.3,17.68 107.14,10.52 105.16,10.52 103.94,9.3 BOTTOMBUS.12 | 56.84,30.02 72.85,30.02 IC3.3 | 56.84,30.02 34.9,30.02 34.75,29.87 34.75,29.57 32.16,26.98 32.16,20.73 31.85,20.42 31.85,19.05 34.9,16 36.88,16 IC7.14 | v93.57,16.76 93.57,19.81 90.98,22.4 90.98,28.96 77.88,42.06 65.53,42.06 56.84,33.38 56.84,30.02
SIGNAL12  (via drill 0.35)
  Top 0.152: 108.81,14.02 108.81,12.19 106.83,10.21 105.92,10.21 105.31,9.6 105.31,7.77 106.22,6.86 BOTTOMBUS.13 | 108.81,14.02 v108.81,17.07 | v55.47,14.78 56.24,14.78 58.52,17.07 58.98,17.07 IC4.7 | v98.91,14.02 108.81,14.02 | v87.63,14.02 87.63,9.6 84.89,6.86 v83.82,6.86
  Bottom 0.152: v108.81,17.07 112.47,20.73 IC27.23 | IC7.15 37.03,14.78 v55.47,14.78 55.47,15.85 55.78,16.15 57.45,16.15 66.75,6.86 v83.82,6.86 | v87.63,14.02 v98.91,14.02
SIGNAL13  (via drill 0.35)
  Top 0.152: v109.42,19.05 109.42,12.34 106.38,9.3 BOTTOMBUS.14 106.38,9.14 106.38,8.08 107.44,7.01 107.44,6.4 106.68,5.64 105.16,5.64 v104.85,5.94 | v56.08,13.41 58.52,15.85 58.98,15.85 IC4.6
  Bottom 0.152: v109.42,19.05 111.86,21.49 112.47,21.49 IC27.24 | IC7.16 37.03,13.41 v56.08,13.41 57.61,13.41 66.9,4.12 81.99,4.12 85.65,7.77 96.62,7.77 97.23,7.16 97.23,6.86 98.45,5.64 104.09,5.64 104.39,5.94 v104.85,5.94
SIGNAL14  (via drill 0.35)
  Top 0.152: 110.64,9.3 v110.64,17.22 | 110.64,9.3 108.97,7.62 108.97,6.86 BOTTOMBUS.15 | v57.3,10.82 58.98,10.82 IC4.2 | 110.64,9.3 110.95,9.3 111.56,8.69 v111.56,5.18 | v110.34,3.96 97.08,3.96 96.16,3.05 91.9,3.05 91.44,2.59 90.07,2.59 88.7,3.96 68.89,3.96 66.14,6.71 v57.91,6.71
  Bottom 0.152: v110.64,17.22 113.69,20.27 113.69,21.95 113.23,22.4 112.62,22.4 IC27.25 | IC7.17 37.03,12.19 37.64,12.19 38.56,13.11 51.66,13.11 53.95,10.82 v57.3,10.82 57.3,7.77 57.91,7.16 v57.91,6.71 | v110.34,3.96 v111.56,5.18
SIGNAL15  (via drill 0.35)
  Top 0.152: v110.03,21.34 110.03,10.36 108.97,9.3 BOTTOMBUS.16 108.81,9.14 108.81,8.08 107.9,7.16 v107.9,5.94 | v51.36,12.5 51.66,12.8 56.39,12.8 57.15,12.04 58.98,12.04 IC4.3 59.13,12.04 v60.66,12.04 | v96.47,4.72 87.48,4.72 86.87,5.33 v81.69,5.33
  Bottom 0.152: v110.03,21.34 111.86,23.16 112.47,23.16 IC27.26 | v51.36,12.5 40.54,12.5 39.01,10.97 37.03,10.97 IC7.18 | v107.9,5.94 106.98,5.94 105.77,4.72 v96.47,4.72 | v81.69,5.33 67.36,5.33 v60.66,12.04
VCC  (via drill 0.35)
  Top 0.152: v39.32,9.45 52.88,9.45 IC4.16 53.03,9.45 53.49,8.99 60.2,8.99 60.66,9.45 v74.52,9.45 | v82.14,24.38 82.14,13.87 82.3,13.72 82.3,12.34 v80.77,10.82 | v37.64,24.38 41.45,24.38 45.57,28.5 52.88,28.5 IC1.16 | 117.35,22.55 115.21,24.69 v115.21,24.84 | 117.35,22.55 v118.26,21.64 118.87,21.03 | 117.35,22.55 v119.63,24.84 | v127.86,26.67 127.86,32.31 134.11,38.56 134.11,42.98 IC5.14 | v122.07,16.61 122.07,17.83 118.87,21.03 | v90.07,25.6 99.06,25.6 103.02,21.64 108.36,21.64 109.27,22.55 116.13,22.55 117.04,21.64 117.04,20.57 117.35,20.27 118.11,20.27 118.87,21.03
  Bottom 0.152: v39.32,9.45 38.86,9.45 37.8,8.38 37.03,8.38 IC7.20 36.88,8.38 36.42,8.38 35.66,9.14 35.66,15.09 35.81,15.24 38.1,15.24 38.41,15.54 38.41,16.31 38.1,16.61 35.81,16.61 34.75,17.68 34.75,19.66 35.97,20.88 35.97,24.23 IC12.20 36.12,24.38 v37.64,24.38 | v74.52,9.45 78.94,9.45 IC2.16 79.1,9.6 79.55,9.6 v80.77,10.82 | IC3.16 79.1,27.43 v82.14,24.38 88.85,24.38 v90.07,25.6 | 114.91,24.84 114.91,27.58 114,28.5 114,29.57 113.84,29.72 113.84,31.55 114.91,32.61 116.13,32.61 117.5,31.24 117.5,30.63 IC27.38 | 114.91,24.84 114.91,24.54 114.45,24.08 112.62,24.08 IC27.27 | v118.26,21.64 118.26,19.05 IC27.17 | 114.91,24.84 v115.21,24.84 | v119.63,24.84 120.4,25.6 124.05,25.6 IC27.5 124.21,25.76 125.88,25.76 126.8,26.67 v127.86,26.67 | v122.07,16.61 133.2,5.49 136.55,5.49 137.77,6.71 138.38,6.71 SV5.5 138.53,6.86 139.45,7.77 139.45,9.75 138.99,10.21 138.99,22.86 141.12,24.99 141.12,26.21 161.39,46.48 180.75,46.48 182.57,44.65 182.88,44.65 J1.2